# EAGLE design ESP8266_Thermostat (EAGLE 7.3.0)
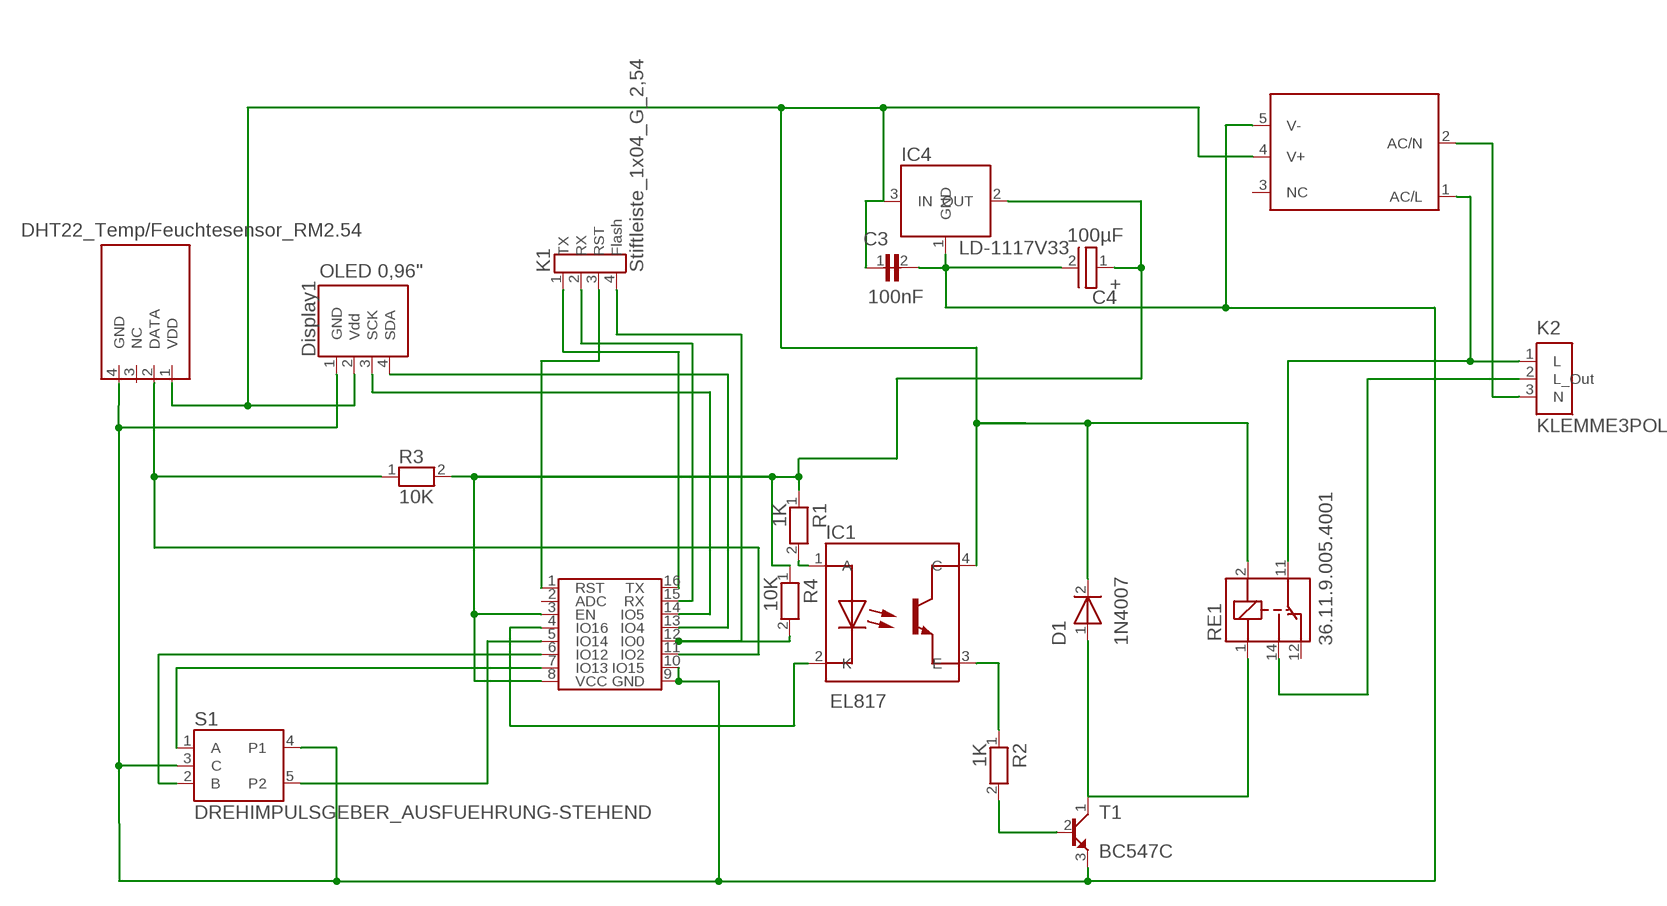
[diagram p0: schematic, sheet 1]

## Parts
C3  100nF  B37987-F5104-K54_15  [3X5R5,08_15]
C4  100µF  B41851-A3107-M_16  [D5R2,54_ELKO_16]
D1  1N4007  1N4007_4  [D_RM12,7_DM3_4]
Display1  OLED 0,96"  OLED_0,96"_9  [OLED_0,96"_9]
IC1  EL817  EL817_0  [DIL4_0]
IC2  ESP8266-07  ESP8266-07_6  [ESP8266-7_6]
IC3  DHT22_Temp/Feuchtesensor_RM2.54  DHT22_Temp/Feuchtesensor_RM2.54_8  [DHT_RM2.54_8]
IC4  LD-1117V33  LD-1117V33_13  [TO220_13]
IC5  IRM-03-5  IRM-03-5_17  [IRM-03-5_17]
K1  Stiftleiste_1x04_G_2,54  Stiftleiste_1x04_G_2,54_11  [Stiftleiste_1x04_G_2,54_11]
K2  KLEMME3POL  KLEMME3POL_14  [KLEMME3_14]
R1  1K  R_MET_1K_0204_1  [0204_MET_1]
R2  1K  R_MET_1K_0204_2  [0204_MET_2]
R3  10K  R_KOHLE_10K_0204_10  [0204_10]
R4  10K  R_KOHLE_10K_0204_12  [0204_12]
RE1  36.11.9.005.4001  36.11.9.005.4001_5  [Finder_36.11-4001_5]
S1  DREHIMPULSGEBER_AUSFUEHRUNG-STEHEND  DREHIMPULSGEBER_AUSFUEHRUNG-STEHEND_7  [DREHIMPULSGEBER_STEHEND_7]
T1  BC547C  BC547C_3  [TO92_3]

## Nets
1: IC1.3(E) R2.1
2: R2.2 T1.2(B)
+3.3V: C4.1(+) IC2.3(EN) IC2.8(VCC) IC4.2(OUT) R1.1 R3.2 R4.1
+5V: C3.1 D1.2(K) Display1.2(Vdd) IC1.4(C) IC3.1(VDD) IC4.3(IN) IC5.4(V+) RE1.2(A2)
A: D1.1(A) RE1.1(A1) T1.1(C)
AC/L: IC5.1(AC/L) K2.1(L) RE1.11
AC/N: IC5.2(AC/N) K2.3(N)
DHT22_DATA: IC2.11(IO2) IC3.2(DATA) R3.1
Flash: IC2.12(IO0) K1.4(Flash) R4.2
GND: C3.2 C4.2(-) Display1.1(GND) IC2.9(GND) IC2.10(IO15) IC3.4(GND) IC4.1(GND) IC5.5(V-) S1.3(C) S1.4(P1) T1.3(E)
OLED_SCK: Display1.3(SCK) IC2.14(IO5)
OLED_SDA: Display1.4(SDA) IC2.13(IO4)
RotEnc_A: IC2.7(IO13) S1.1(A)
RotEnc_B: IC2.6(IO12) S1.2(B)
RotEnc_P2: IC2.5(IO14) S1.5(P2)
RST: IC2.1(RST) K1.3(RST)
RX: IC2.15(RX) K1.2(RX)
Sig$7: IC1.1(A) R1.2
Sig$20: K2.2(L_Out) RE1.14
Switch_OC_Relais: IC1.2(K) IC2.4(IO16)
TX: IC2.16(TX) K1.1(TX)
Unconnected: IC2.2(ADC) IC3.3(NC) IC5.3(NC) RE1.12

## Library data of the parts
C3 = TARGET3001!_V19.3.0.11:B37987-F5104-K54_15: KERAMIK KONDENSATOR VS PRINT X7R 100 NF Rastermaß e = 5,0 mm, Kapazitätstoleranz ±10%, 50 V. Gegurtet. (X7R) CN/nF 100 ; Typ B37987-F5104-K5
C4 = TARGET3001!_V19.3.0.11:B41851-A3107-M_16: Elektrolyt-Kondensatoren radial 105 øC, B41851-A3107-M..., Elko 100uF 10V , B41851-A3107-M [100UF]
D1 = TARGET3001!_V19.3.0.11:1N4007_4: Universal-Diode 1000V, 1A
Display1 = TARGET3001!_V19.3.0.11:OLED_0,96"_9: Buchsenleiste 4-polig RM2,54
IC1 = TARGET3001!_V19.3.0.11:EL817_0
IC2 = TARGET3001!_V19.3.0.11:ESP8266-07_6: ESP-07 WiFi module is developed by Ai-thinker Team 32-bit MCU, 802.11 b/g/n, SDIO 2.0, (H) SPI, UART, I2C, I2S, IRDA, PWM, GPIO, Deep sleep power <10uA, Power down leakage current < 5uA
IC3 = TARGET3001!_V19.3.0.11:DHT22_Temp/Feuchtesensor_RM2.54_8
IC4 = TARGET3001!_V19.3.0.11:LD-1117V33_13: 0,8A Low-Drop-Spannungsregler 3,3V
IC5 = TARGET3001!_V19.3.0.11:IRM-03-5_17: AC-DC MODULE 3W SINGLE OUTPUT ENCAPSULATED TYPE Leistung 3 W Ausgangsspannung 1 5 VDC Ausgangsstrom 1 600 mA Anzahl der Ausgänge 1 Ausgang Eingangsspannung AC 85...305 VAC Eingangsspannung DC 120...430 VDC Abmessungen L x B x H 37.0 x 24.0 x 15.0 mm
K1 = TARGET3001!_V19.3.0.11:Stiftleiste_1x04_G_2,54_11: Stiftleiste
K2 = TARGET3001!_V19.3.0.11:KLEMME3POL_14: Schraubklemme 3-polig RM5,08
R1 = TARGET3001!_V19.3.0.11:R_MET_1K_0204_1: Metallschichtwiderstand 1K-Ohm, 0,4W, 1%
R2 = TARGET3001!_V19.3.0.11:R_MET_1K_0204_2: Metallschichtwiderstand 1K-Ohm, 0,4W, 1%
R3 = TARGET3001!_V19.3.0.11:R_KOHLE_10K_0204_10: Kohleschichtwiderstand 10K-Ohm, 0,1W, 5%
R4 = TARGET3001!_V19.3.0.11:R_KOHLE_10K_0204_12: Kohleschichtwiderstand 10K-Ohm, 0,1W, 5%
RE1 = TARGET3001!_V19.3.0.11:36.11.9.005.4001_5: Kleines Leistungsrelais, Würfelbauform
S1 = TARGET3001!_V19.3.0.11:DREHIMPULSGEBER_AUSFUEHRUNG-STEHEND_7: DREHIMPULSGEBER STEHEND Drehimpulsgeber Dieser Drehimpulsgeber (30 Stellungen) in Miniaturbauform bietet sich für Einstellungen digitaler Werte in Geräten an. Er verfügt über einen getrennten Impulsausgang für beide Drehrichtungen (rechts/links-Kennung) sowie eine exakte leichtgängige Rastung; beim Drücken der Achse ist ein zusätzlicher Impuls für eine Set- bzw. Reset-Funktion möglich. Technische Daten: Anschlüsse Raster 2,5 mm - Gehäuse UL-94-VO - Max. 5 V/DC 10 mA - Durchgangswiderstand < 1 m Ohm - Isolationswiderstand > 100 M Ohm - Drehwinkel 360° endlos - Je 15 Impulse pro Umdrehung zwischen A-C und B-C. Ausführung stehen
T1 = TARGET3001!_V19.3.0.11:BC547C_3: Bipolar-Standard-Leistungstransistor UCE:45V, ICE:0,2A, max800

## Board
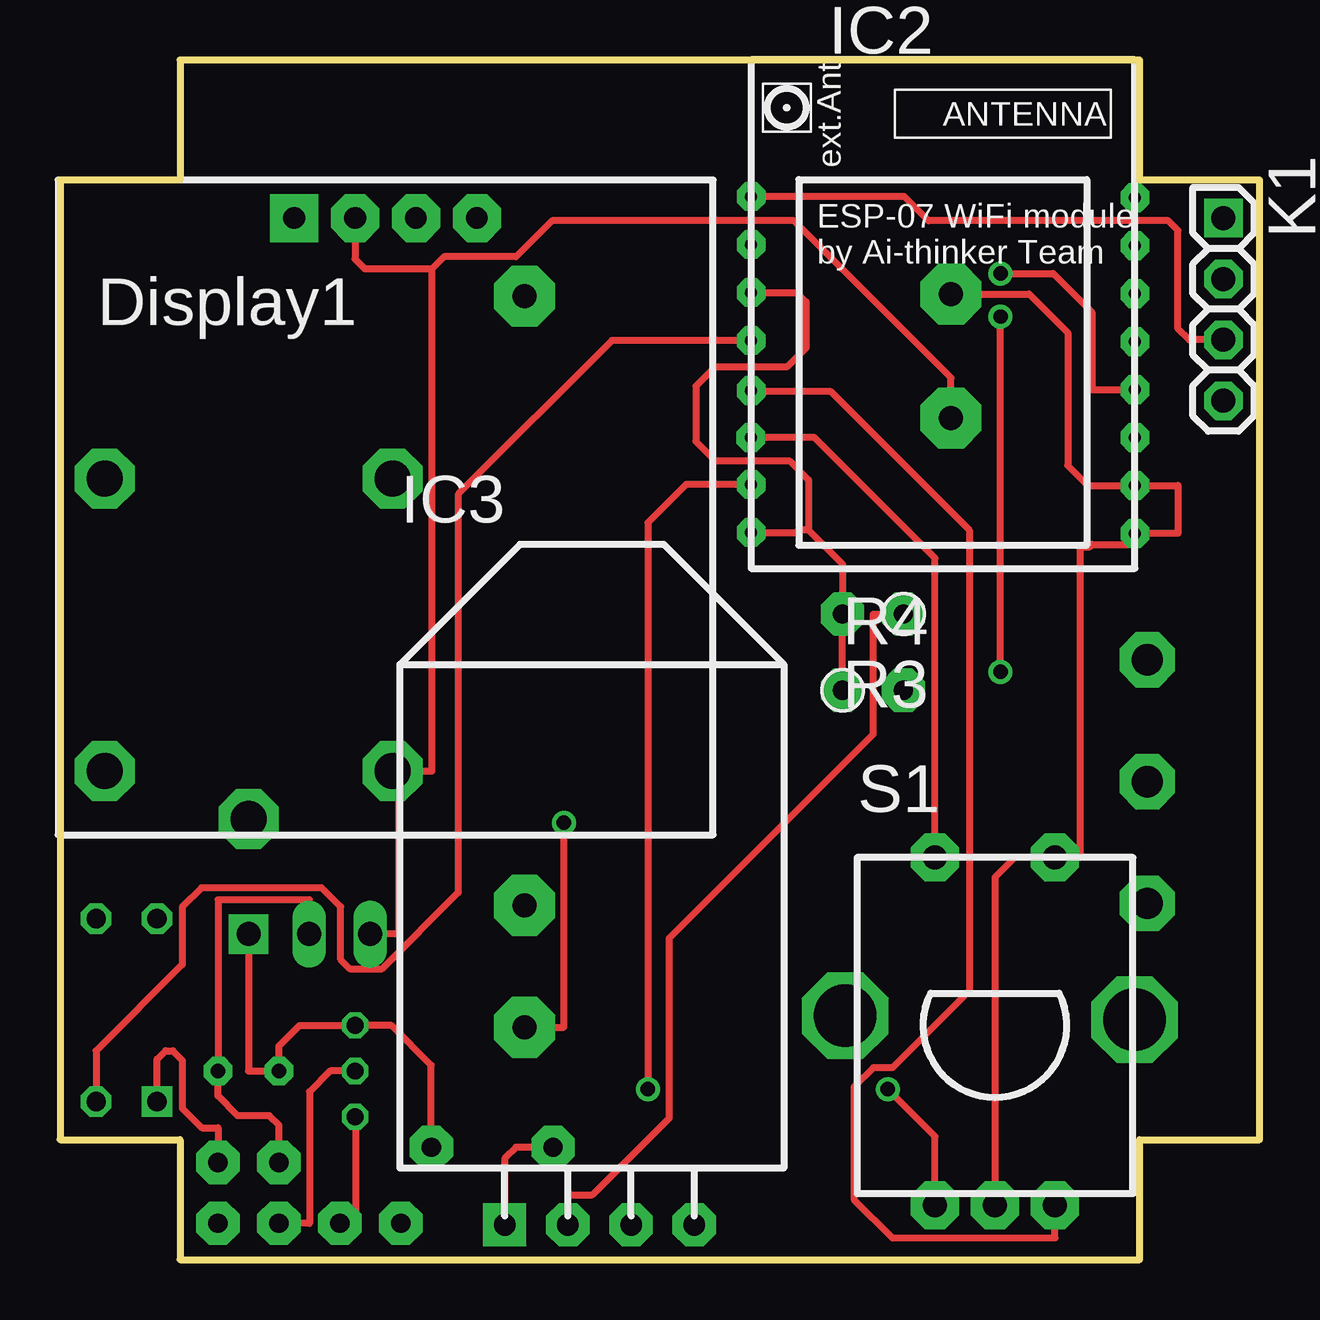
[diagram p1: board, top side]
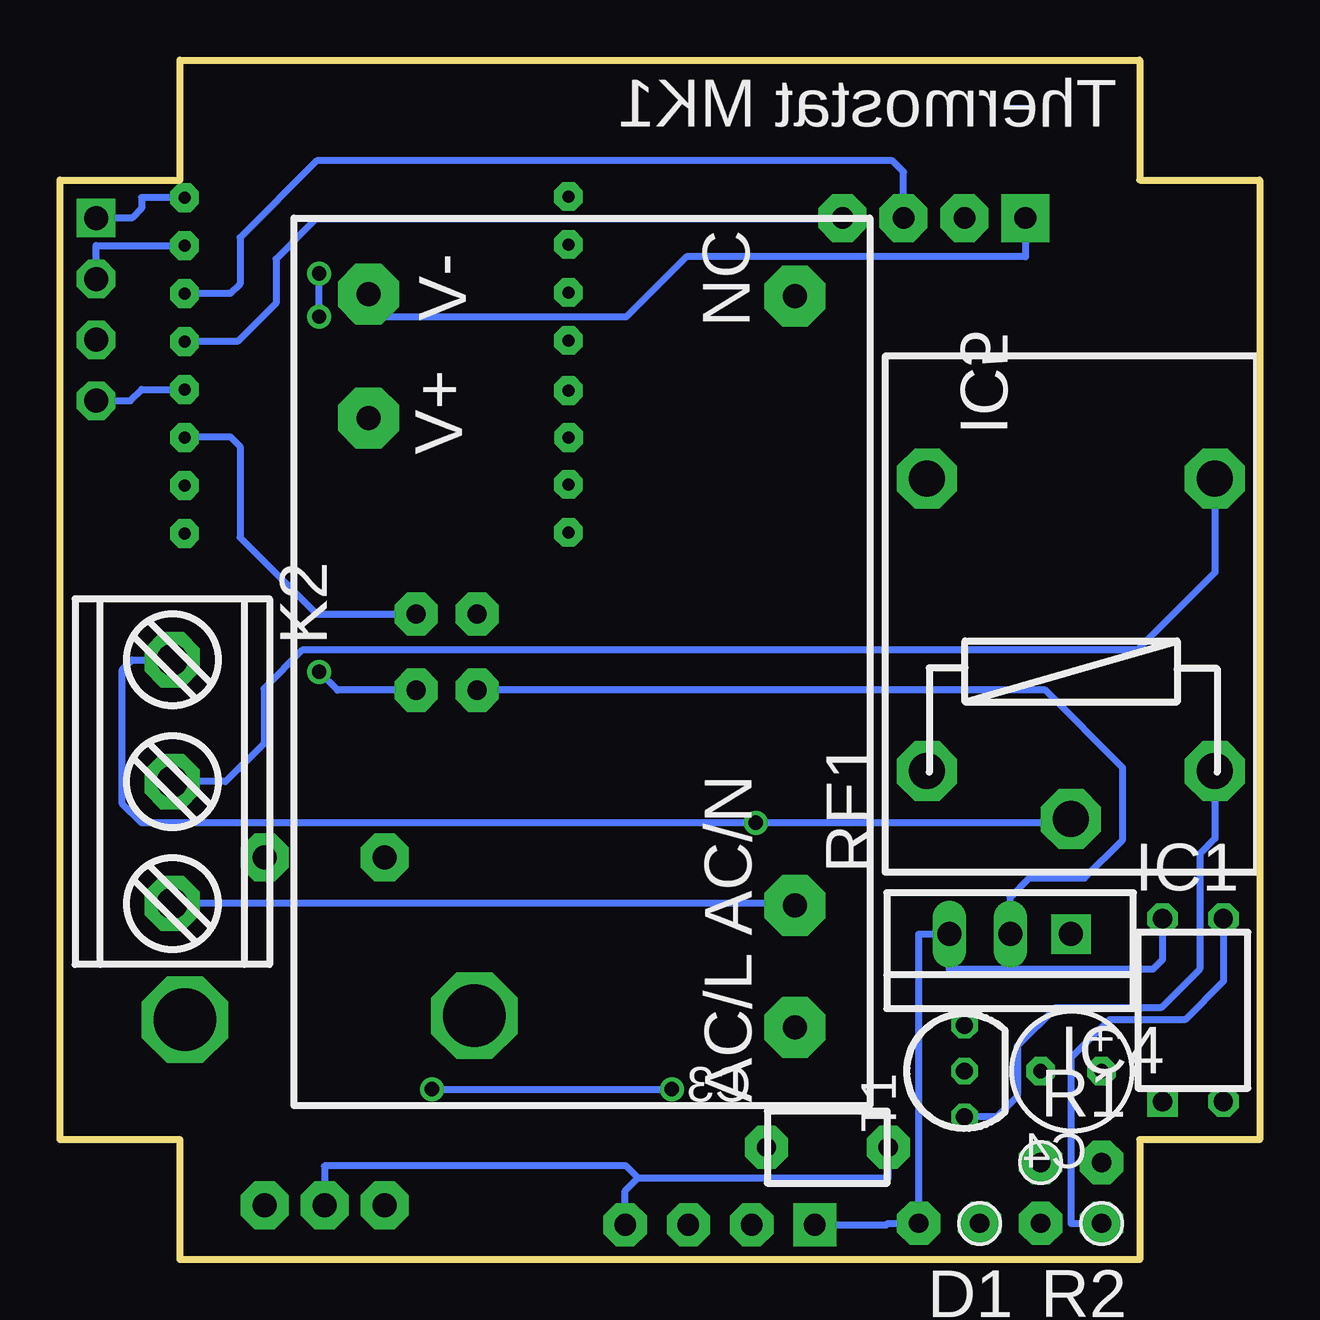
[diagram p2: board, bottom side, seen from below]

Size 50 x 50 mm. Coordinates in mm from the lower left corner, seen from the top.
Outline: 5,50 5,45 0,45 0,5 5,5 5,0 45,0 45,5 50,5 50,45 45,45 45,50 5,50
Copper layers (1*16): Top 0.035mm / dielectric 1.5mm / Bottom 0.035mm
Design rules "TARGET3001!": minimum track width 0.3mm, minimum drill 0.6mm, track to track 0.2mm, track to pad 0.2mm, pad to pad 0.2mm, via to via 0.2mm, smd to smd 0mm, copper to edge 0mm, drill to drill 0.3mm, minimum pad ring 0.2mm, minimum via ring 0.2mm, stop-mask expansion 4mil, vias tented up to drill 0mil, thermal gap 10mil

### Footprints (pad centres in the part's own frame; a part is rotated, then mirrored left to right if it is on the bottom)
3X5R5,08_15 = drill 0.8 pad 1.8 octagon: 1 2.54,0; 2 -2.54,0
D5R2,54_ELKO_16 = drill 0.6 pad 1.2 octagon: 1 -1.27,0; 2 1.27,0
D_RM12,7_DM3_4 = drill 0.8 pad 1.8 octagon: 1 0,0; 2 2.54,0
OLED_0,96"_9 = drill 0.9 pad 2 square: 1 -3.81,0 | drill 0.9 pad 2 octagon: 2 -1.27,0; 3 1.27,0; 4 3.81,0
DIL4_0 = drill 0.8 pad 1.27 square: 1 1.27,-3.81 | drill 0.8 pad 1.27 octagon: 2 -1.27,-3.81; 3 -1.27,3.81; 4 1.27,3.81
ESP8266-7_6 = drill 0.5 pad 1.2 octagon: 1 0,15.5; 2 0,13.5; 3 0,11.5; 4 0,9.5; 5 -0.018,5.452; 6 0,7.405; 7 0,3.5; 8 0,1.5; 9 16,1.452; 10 16,3.453; 11 16,5.452; 12 16,7.452; 13 16,9.453; 14 16,11.453; 15 16,13.453; 16 16,15.453
DHT_RM2.54_8 = drill 0.9 pad 1.8 square: 1 1.155,-22.283 | drill 0.9 pad 1.8 octagon: 2 3.79,-22.283; 3 6.425,-22.283; 4 9.06,-22.283
TO220_13 = drill 1 pad 1.651 square: 1 -2.54,0 | drill 1 pad 0.326 long: 2 0,0; 3 2.54,0
IRM-03-5_17 = drill 1 pad 2.54 octagon: 1 -20.876,-33.734; 2 -20.876,-28.654; 3 -20.876,-3.254; 4 -3.096,-8.334; 5 -3.096,-3.175
Stiftleiste_1x04_G_2,54_11 = drill 1 pad 1.6 square: 1 0,0 | drill 1 pad 1.6 octagon: 2 0,-2.54; 3 0,-5.08; 4 0,-7.62
KLEMME3_14 = drill 1.3 pad 2.3 octagon: 1 -0.635,5.08; 2 -0.635,0; 3 -0.635,-5.08
0204_MET_1 = drill 0.8 pad 1.8 octagon: 1 0,0; 2 -2.54,0
0204_MET_2 = drill 0.8 pad 1.8 octagon: 1 0,0; 2 2.54,0
0204_10 = drill 0.8 pad 1.8 octagon: 1 0,0; 2 -2.54,0
0204_12 = drill 0.8 pad 1.8 octagon: 1 0,0; 2 2.54,0
Finder_36.11-4001_5 = drill 1.5 pad 2.5 octagon: 1 -6,-6.55; 2 6,-6.55; 11 0,-8.55; 12 6,5.65; 14 -6,5.65
DREHIMPULSGEBER_STEHEND_7 = drill 1 pad 2 octagon: 1 -2.5,-7.5; 2 2.5,-7.5; 3 0,-7.5; 4 2.5,7; 5 -2.5,7 | drill 2.6 pad 3.6 octagon: VIA_0 -6.245,0.4; VIA_1 5.82,0.235
TO92_3 = drill 0.7 pad 1.1 octagon: 1 0,-1.905; 2 0,0; 3 0,1.905

### Placement (x,y rotation side)
C3  18.02,4.68 0 top
C4  7.86,7.86 0 top
D1  11.66,1.5 0 top
Display1  13.57,43.41 0 top
IC1  2.77,10.39 0 top
IC2  28.81,28.81 0 top
IC3  17.38,23.73 0 top
IC4  10.39,13.57 0 top
IC5  40.24,43.41 0 top
K1  48.5,43.41 0 top
K2  45.95,19.92 0 top
R1  9.12,4.05 0 top
R2  6.59,1.5 0 top
R3  35.16,26.91 0 top
R4  32.62,23.73 0 top
RE1  7.86,26.91 0 top
S1  38.97,9.76 0 top
T1  12.3,7.86 0 top

### Tracks (layer width: path | path; a pad name or v marks a point on that pad's centre or on a via)
1
  Bottom 0.3: IC1.3 1.5,11.6 3.1,10 6.25,10 7.86,8.4 7.86,1.5 R2.1
2
  Top 0.3: T1.2 11.26,7.86 10.4,7 10.4,1.5 R2.2
+3.3V
  Top 0.3: IC4.2 10.39,15 6.59,15 C4.1 6.59,6.82 7.4,6 8.73,6 9.12,5.6 R1.1 | 31.2,30.4 32.62,28.98 R3.2 R4.1 | 31.2,30.4 30.79,30.4 30.7,30.31 IC2.8 | IC2.3 30.7,40.31 31.1,39.91 31.1,38 30.3,37.2 27.3,37.2 26.5,36.4 26.5,34.1 27.3,33.3 30.4,33.3 31.2,32.5 31.2,30.4
  Bottom 0.3: IC4.2 10.39,15.1 9.6,15.9 7.3,15.9 5.7,17.5 5.7,20.5 8.93,23.73 R4.1
+5V
  Top 0.3: 14.11,20.36 15.5,20.36 15.5,41.3 | 14.11,20.36 14.11,13.57 IC4.3 | RE1.2 14.11,20.36 | IC5.4 37.14,36.76 30.6,43.3 20.5,43.3 19,41.8 16,41.8 15.5,41.3 | C3.1 19,4.68 18.54,4.21 IC3.1 | Display1.2 12.3,41.7 12.7,41.3 15.5,41.3
  Bottom 0.3: IC3.1 15.56,1.45 15.5,1.5 D1.2 14.21,13.57 IC4.3 12.94,12.1 4.45,12.1 4.05,12.5 IC1.4
A
  Top 0.3: D1.1 12.34,1.5 12.34,5.95 T1.1
  Bottom 0.3: RE1.1 1.86,17.55 2.5,16.9 2.5,12.1 4.1,10.5 8.5,10.5 10.1,8.9 10.1,6.8 10.95,5.95 T1.1
AC/L  (via drill 0.6 pad 1)
  Top 0.3: K2.1 45.6,25 | IC5.1 21,9.68 v21,18.2
  Bottom 0.3: RE1.11 7.86,18.2 v21,18.2 46.6,18.2 47.4,19 47.4,24.6 47,25 K2.1
AC/N
  Bottom 0.3: IC5.2 19.36,14.84 K2.3
DHT22_DATA
  Top 0.3: 35.17,26.27 R3.1 33.9,26.91 33.9,21.9 25.4,13.4 25.4,5.9 22.2,2.7 21.17,2.7 IC3.2
  Bottom 0.3: IC2.11 44.81,34.29 42.9,34.29 42.5,33.89 42.5,30.1 39.3,26.91 R3.1
Flash  (via drill 0.6 pad 1)
  Top 0.3: v39.2,24.5 v39.2,39.3 | v39.2,41.1 41.4,41.1 43,39.5 43,36.26 IC2.12
  Bottom 0.3: R4.2 38.43,23.73 v39.2,24.5 | v39.2,39.3 v39.2,41.1 | K1.4 47.07,35.8 46.6,36.26 IC2.12
GND
  Top 0.3: S1.3 38.97,15.93 39.8,16.76 S1.4 42.5,16.76 42.5,29.7 42.92,29.7 43.03,29.81 44.81,29.81 IC2.9 46.6,30.26 46.6,32.26 IC2.10 42.84,32.26 42,33.1 42,38.64 40.4,40.24 IC5.5 | C3.2 15.47,8.1 13.81,9.76 T1.3 9.98,9.76 9.12,8.9 C4.2 7.86,7.86 IC4.1
  Bottom 0.3: Display1.1 9.76,41.8 23.89,41.8 26.4,39.29 37.14,39.29 IC5.5 | 25.9,3.4 26.4,3.9 38.97,3.9 S1.3 | 25.9,3.4 15.47,3.4 C3.2 | IC3.4 26.44,2.86 25.9,3.4
OLED_SCK
  Bottom 0.3: Display1.3 14.84,45.34 15.3,45.8 39.3,45.8 42.5,42.6 42.5,40.66 42.9,40.26 IC2.14
OLED_SDA
  Bottom 0.3: Display1.4 17.38,43.36 39.34,43.36 41,41.7 41,39.86 42.6,38.26 IC2.13
RotEnc_A  (via drill 0.6 pad 1)
  Top 0.3: S1.1 36.47,5.13 v34.5,7.1 | IC2.7 26.1,32.31 24.5,30.71 v24.5,7.1
  Bottom 0.3: v34.5,7.1 v24.5,7.1
RotEnc_B
  Top 0.3: IC2.6 28.81,36.19 32.11,36.19 37.9,30.4 37.9,11.2 34.7,8 33.9,8 33.1,7.2 33.1,2.5 34.7,0.9 41.47,0.9 S1.2
RotEnc_P2
  Top 0.3: S1.5 36.47,29.23 31.44,34.26 IC2.5
RST
  Top 0.3: K1.3 47.06,38.34 46.6,38.8 46.6,42.9 46.2,43.3 36.2,43.3 35.19,44.31 IC2.1
RX
  Bottom 0.3: K1.2 48.5,42.26 IC2.15
Sig$7
  Top 0.3: IC1.1 4.05,8.34 4.4,8.7 4.7,8.7 5.1,8.3 5.1,6.3 5.9,5.5 6.59,5.5 R1.2
Sig$20
  Bottom 0.3: RE1.14 1.86,28.64 5.1,25.4 39.9,25.4 41.5,23.8 41.5,21.52 43.1,19.92 K2.2
Switch_OC_Relais
  Top 0.3: IC2.4 23.01,38.31 16.6,31.9 16.6,15.3 13.4,12.1 12.1,12.1 11.7,12.5 11.7,14.7 10.9,15.5 5.9,15.5 5.1,14.7 5.1,12.3 1.5,8.7 IC1.2
TX
  Bottom 0.3: IC2.16 46.6,44.26 46.6,43.81 47,43.41 K1.1

### Text on the board
bPlace: Thermostat MK1